# EasyEDA schematic DMX Shield 3 universe.json
TITLE: Sheet_1; REV: 1.0; Date: 2021-08-17; Sheet: 1/1; Drawn By: confusedtx5; Company: Your Company
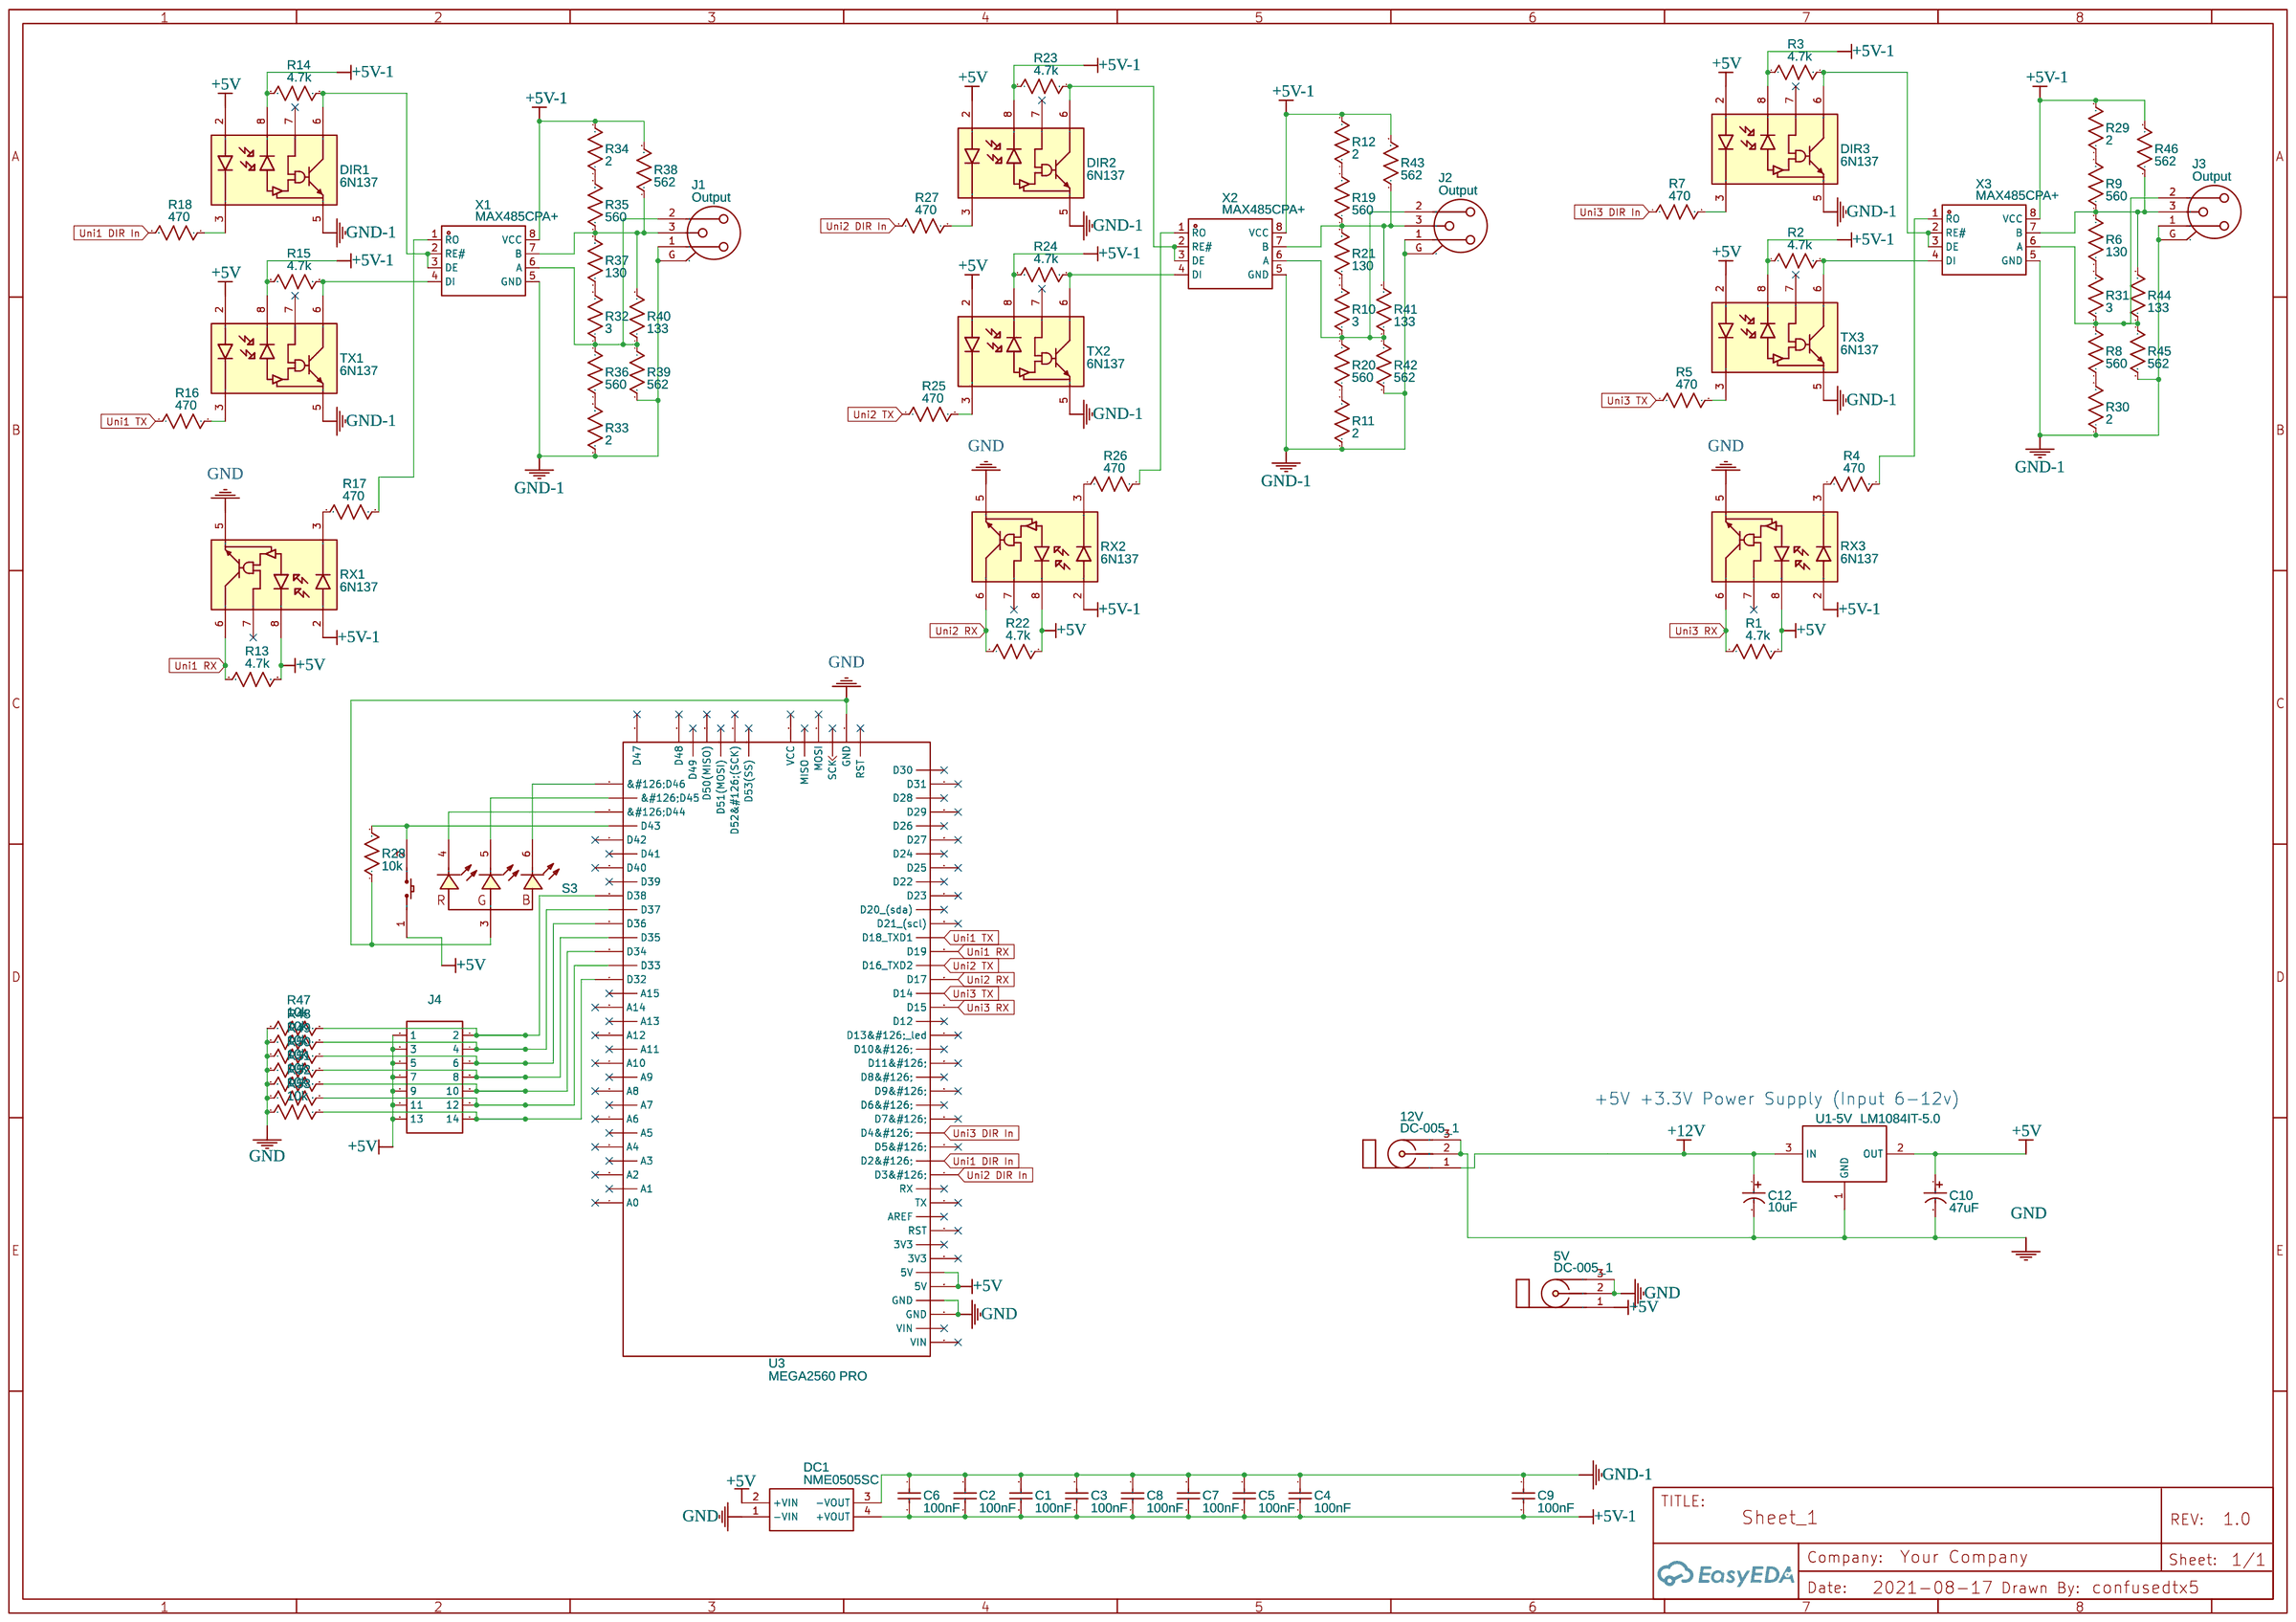
[diagram p0: schematic sheet]

## Parts
5V  DC-005_1  [DC-5020]
12V  DC-005_1  [DC-5020]
C1  100nF  [CAP-TH_L5.0-W5.0-P5.08-D1.0]
C2  100nF  [CAP-TH_L5.0-W5.0-P5.08-D1.0]
C3  100nF  [CAP-TH_L5.0-W5.0-P5.08-D1.0]
C4  100nF  [CAP-TH_L5.0-W5.0-P5.08-D1.0]
C5  100nF  [CAP-TH_L5.0-W5.0-P5.08-D1.0]
C6  100nF  [CAP-TH_L5.0-W5.0-P5.08-D1.0]
C7  100nF  [CAP-TH_L5.0-W5.0-P5.08-D1.0]
C8  100nF  [CAP-TH_L5.0-W5.0-P5.08-D1.0]
C9  100nF  [CAP-TH_L5.0-W5.0-P5.08-D1.0]
C10  47uF  [CAP-TH_BD5.0-P2.00-D0.8-FD]
C12  10uF  [CAP-TH_BD5.0-P2.00-D0.8-FD]
DC1  NME0505SC  [NME0505SC]
DIR1  6N137  [DIP-8_L10.0-W6.5-P2.54-LS7.6-BL]
DIR2  6N137  [DIP-8_L10.0-W6.5-P2.54-LS7.6-BL]
DIR3  6N137  [DIP-8_L10.0-W6.5-P2.54-LS7.6-BL]
J1  Output  [CONN-TH_XLR-328-2]
J2  Output  [CONN-TH_XLR-328-2]
J3  Output  [CONN-TH_XLR-328-2]
J4  Header-Male-2.54_2x7  [HDR-TH_14P-P2.54-V-M-R2-C7-S2.54]
R1  4.7k  [R0805]
R2  4.7k  [R0805]
R3  4.7k  [R0805]
R4  470  [R0805]
R5  470  [R0805]
R6  130  [R0805]
R7  470  [R0805]
R8  560  [R0805]
R9  560  [R0805]
R10  3  [R0805]
R11  2  [R0805]
R12  2  [R0805]
R13  4.7k  [R0805]
R14  4.7k  [R0805]
R15  4.7k  [R0805]
R16  470  [R0805]
R17  470  [R0805]
R18  470  [R0805]
R19  560  [R0805]
R20  560  [R0805]
R21  130  [R0805]
R22  4.7k  [R0805]
R23  4.7k  [R0805]
R24  4.7k  [R0805]
R25  470  [R0805]
R26  470  [R0805]
R27  470  [R0805]
R28  10k  [R0805]
R29  2  [R0805]
R30  2  [R0805]
R31  3  [R0805]
R32  3  [R0805]
R33  2  [R0805]
R34  2  [R0805]
R35  560  [R0805]
R36  560  [R0805]
R37  130  [R0805]
R38  562  [R0805]
R39  562  [R0805]
R40  133  [R0805]
R41  133  [R0805]
R42  562  [R0805]
R43  562  [R0805]
R44  133  [R0805]
R45  562  [R0805]
R46  562  [R0805]
R47  10k  [R0805]
R48  10k  [R0805]
R49  10k  [R0805]
R50  10k  [R0805]
R51  10k  [R0805]
R52  10k  [R0805]
R53  10k  [R0805]
RX1  6N137  [DIP-8_L10.0-W6.5-P2.54-LS7.6-BL]
RX2  6N137  [DIP-8_L10.0-W6.5-P2.54-LS7.6-BL]
RX3  6N137  [DIP-8_L10.0-W6.5-P2.54-LS7.6-BL]
S3  RGB CA MOMENTARY BUTTON  [RGB CA MOMENTARY BUTTON HEADERS]
TX1  6N137  [DIP-8_L10.0-W6.5-P2.54-LS7.6-BL]
TX2  6N137  [DIP-8_L10.0-W6.5-P2.54-LS7.6-BL]
TX3  6N137  [DIP-8_L10.0-W6.5-P2.54-LS7.6-BL]
U1-5V  LM1084IT-5.0  [TO-220-3_L10.0-W4.5-P2.54-L]
U3  MEGA2560 PRO  [MEGA2560 PRO-CH340G]
X1  MAX485CPA+  [DIP-8_L10.0-W6.5-P2.54-LS7.6-BL]
X2  MAX485CPA+  [DIP-8_L10.0-W6.5-P2.54-LS7.6-BL]
X3  MAX485CPA+  [DIP-8_L10.0-W6.5-P2.54-LS7.6-BL]

## Library data of the parts
5V 12V = -: LCSC: E66437; Supplier: EasyEDA; Manufacturer: EasyEDA
C1-C9 = SR211C104KAR: Supplier: LCSC; Supplier Part: C444738; Manufacturer: AVX; Contributor: LCSC; JLCPCB Part Class: Extended Part
C10 = 47UF16V: Supplier: LCSC; Manufacturer: ValuePro; Supplier Part: C30224; JLCPCB Part Class: Extended Part
C12 = -: Voltage: 25V; Supplier: LCSC; Manufacturer: ValuePro; Manufacturer Part: 10uF 25V RHOS; Supplier Part: C19576
DC1 = NME0505SC: Contributor: Aquaatic
DIR1-DIR3 RX1-RX3 TX1-TX3 = 6N137: OPTO ISOLATOR-A
J1-J3 = XLR-328-2: Supplier: LCSC; Supplier Part: C309331; Manufacturer: HOOYA; Contributor: LCSC; JLCPCB Part Class: Extended Part
J4 = Header-Male-2.54_2x7: Supplier: LCSC; Manufacturer: BOOMELE; Manufacturer Part: Double row of needle2X7P 2.54mm; Supplier Part: C71397; JLCPCB Part Class: Extended Part
R1-R53 = R_0805_US: Contributor: LCEDA_Lib
S3 = RGB CA MOMENTARY BUTTON: Manufacturer: EARU; Contributor: LCSC
U1-5V = LM1084IT-5.0: Supplier: LCSC; Manufacturer: TI; Supplier Part: C9719; JLCPCB Part Class: Extended Part
U3 = MEGA2560 PRO: Manufacturer: RobotDyn; Manufacturer Part: MEGA2560 PRO-ch340G; Supplier Part: MEGA2560 PRO-ch340G; link: https://robotdyn.com/mega-2560-pro-embed-ch340g-atmega2560-16au.html; Contributor: kimkwan
X1-X3 = MAX485CPA+: Supplier: LCSC; Supplier Part: C77792; Manufacturer: Maxim Integrated; Contributor: LCSC; JLCPCB Part Class: Extended Part

## Nets
+5V: 5V.1 C10.1 DC1.2(+VIN) DIR1.2 DIR2.2 DIR3.2 J4.1 J4.3 J4.5 J4.7 J4.9 J4.11 J4.13 R1.2 R13.2 R22.2 RX1.8 RX2.8 RX3.8 S3.1(NO1) TX1.2 TX2.2 TX3.2 U1-5V.2(OUT) U3.81(5V) U3.82(5V)
+5V-1: C1.2 C2.2 C3.2 C4.2 C5.2 C6.2 C7.2 C8.2 C9.2 DC1.4(+VOUT) DIR1.8 DIR2.8 DIR3.8 R2.1 R3.1 R12.2 R14.1 R15.1 R23.1 R24.1 R29.2 R34.2 R38.2 R43.2 R46.2 RX1.2 RX2.2 RX3.2 TX1.8 TX2.8 TX3.8 X1.8(VCC) X2.8(VCC) X3.8(VCC)
+12V: 12V.1 C12.1 U1-5V.3(IN)
GND: 5V.2(VCC) 5V.3 12V.2(VCC) 12V.3 C10.2 C12.2 DC1.1(-VIN) R28.1 R47.1 R48.1 R49.1 R50.1 R51.1 R52.1 R53.1 RX1.5 RX2.5 RX3.5 S3.3(CA) U1-5V.1(GND) U3.43(GND) U3.83(GND) U3.84(GND)
GND-1: C1.1 C2.1 C3.1 C4.1 C5.1 C6.1 C7.1 C8.1 C9.1 DC1.3(-VOUT) DIR1.5 DIR2.5 DIR3.5 J1.1 J1.G J2.1 J2.G J3.1 J3.G R11.1 R30.1 R33.1 R39.2 R42.2 R45.2 TX1.5 TX2.5 TX3.5 X1.5(GND) X2.5(GND) X3.5(GND)
Uni1 DIR In: R18.1 U3.73(D2&#126;)
Uni1 RX: R13.1 RX1.6 U3.58(D19)
Uni1 TX: R16.1 U3.57(D18 TXD1)
Uni2 DIR In: R27.1 U3.74(D3&#126;)
Uni2 RX: R22.1 RX2.6 U3.60(D17)
Uni2 TX: R25.1 U3.59(D16 TXD2)
Uni3 DIR In: R7.1 U3.71(D4&#126;)
Uni3 RX: R1.1 RX3.6 U3.62(D15)
Uni3 TX: R5.1 U3.61(D14)
Net-(DIR1-3): DIR1.3 R18.2
Net-(DIR1-6): DIR1.6 R14.2 X1.2(RE#) X1.3(DE)
Net-(DIR2-3): DIR2.3 R27.2
Net-(DIR2-6): DIR2.6 R23.2 X2.2(RE#) X2.3(DE)
Net-(DIR3-3): DIR3.3 R7.2
Net-(DIR3-6): DIR3.6 R3.2 X3.2(RE#) X3.3(DE)
Net-(J1-2): J1.2 R32.1 R36.2 R39.1 R40.1 X1.6(A)
Net-(J1-3): J1.3 R35.1 R37.2 R38.1 R40.2 X1.7(B)
Net-(J2-2): J2.2 R10.1 R20.2 R41.1 R42.1 X2.6(A)
Net-(J2-3): J2.3 R19.1 R21.2 R41.2 R43.1 X2.7(B)
Net-(J3-2): J3.2 R8.2 R31.1 R44.1 R45.1 X3.6(A)
Net-(J3-3): J3.3 R6.2 R9.1 R44.2 R46.1 X3.7(B)
Net-(J4-2): J4.2 R47.2 U3.23(D38)
Net-(J4-4): J4.4 R48.2 U3.22(D37)
Net-(J4-6): J4.6 R49.2 U3.21(D36)
Net-(J4-8): J4.8 R50.2 U3.20(D35)
Net-(J4-10): J4.10 R51.2 U3.19(D34)
Net-(J4-12): J4.12 R52.2 U3.18(D33)
Net-(J4-14): J4.14 R53.2 U3.17(D32)
Net-(R2-2): R2.2 TX3.6 X3.4(DI)
Net-(R4-1): R4.1 RX3.3
Net-(R4-2): R4.2 X3.1(RO)
Net-(R5-2): R5.2 TX3.3
Net-(R6-1): R6.1 R31.2
Net-(R8-1): R8.1 R30.2
Net-(R9-2): R9.2 R29.1
Net-(R10-2): R10.2 R21.1
Net-(R11-2): R11.2 R20.1
Net-(R12-1): R12.1 R19.2
Net-(R15-2): R15.2 TX1.6 X1.4(DI)
Net-(R16-2): R16.2 TX1.3
Net-(R17-1): R17.1 RX1.3
Net-(R17-2): R17.2 X1.1(RO)
Net-(R24-2): R24.2 TX2.6 X2.4(DI)
Net-(R25-2): R25.2 TX2.3
Net-(R26-1): R26.1 RX2.3
Net-(R26-2): R26.2 X2.1(RO)
Net-(R28-2): R28.2 S3.2(NO2) U3.28(D43)
Net-(R32-2): R32.2 R37.1
Net-(R33-2): R33.2 R36.1
Net-(R34-1): R34.1 R35.2
Net-(S3-4): S3.4(KR) U3.29(&#126;D44)
Net-(S3-5): S3.5(KG) U3.30(&#126;D45)
Net-(S3-6): S3.6(KB) U3.31(&#126;D46)

Not connected (* = marked no-connect by the designer): DIR1 7*; DIR2 7*; DIR3 7*; RX1 7*; RX2 7*; RX3 7*; TX1 7*; TX2 7*; TX3 7*; U3 1(A0)* 2(A1)* 3(A2)* 4(A3)* 5(A4)* 6(A5)* 7(A6)* 8(A7)* 9(A8)* 10(A9)* 11(A10)* 12(A11)* 13(A12)* 14(A13)* 15(A14)* 16(A15)* 24(D39)* 25(D40)* 26(D41)* 27(D42)* 32(D47)* 33(D48)* 34(D49)* 35(D50(MISO))* 36(D51(MOSI))* 37(D52&#126;(SCK))* 38(D53(SS))* 39(VCC)* 40(MISO)* 41(MOSI)* 42(SCK)* 44(RST)* 45(D30)* 46(D31)* 47(D28)* 48(D29)* 49(D26)* 50(D27)* 51(D24)* 52(D25)* 53(D22)* 54(D23)* 55(D20 (sda))* 56(D21 (scl))* 63(D12)* 64(D13&#126; led)* 65(D10&#126;)* 66(D11&#126;)* 67(D8&#126;)* 68(D9&#126;)* 69(D6&#126;)* 70(D7&#126;)* 72(D5&#126;)* 75(RX)* 76(TX)* 77(AREF)* 78(RST)* 79(3V3)* 80(3V3)* 85(VIN)* 86(VIN)*

## Notes on the sheet
- +5V +3.3V Power Supply (Input 6-12v)
